# Altium project testMpptCharger.PrjPcb
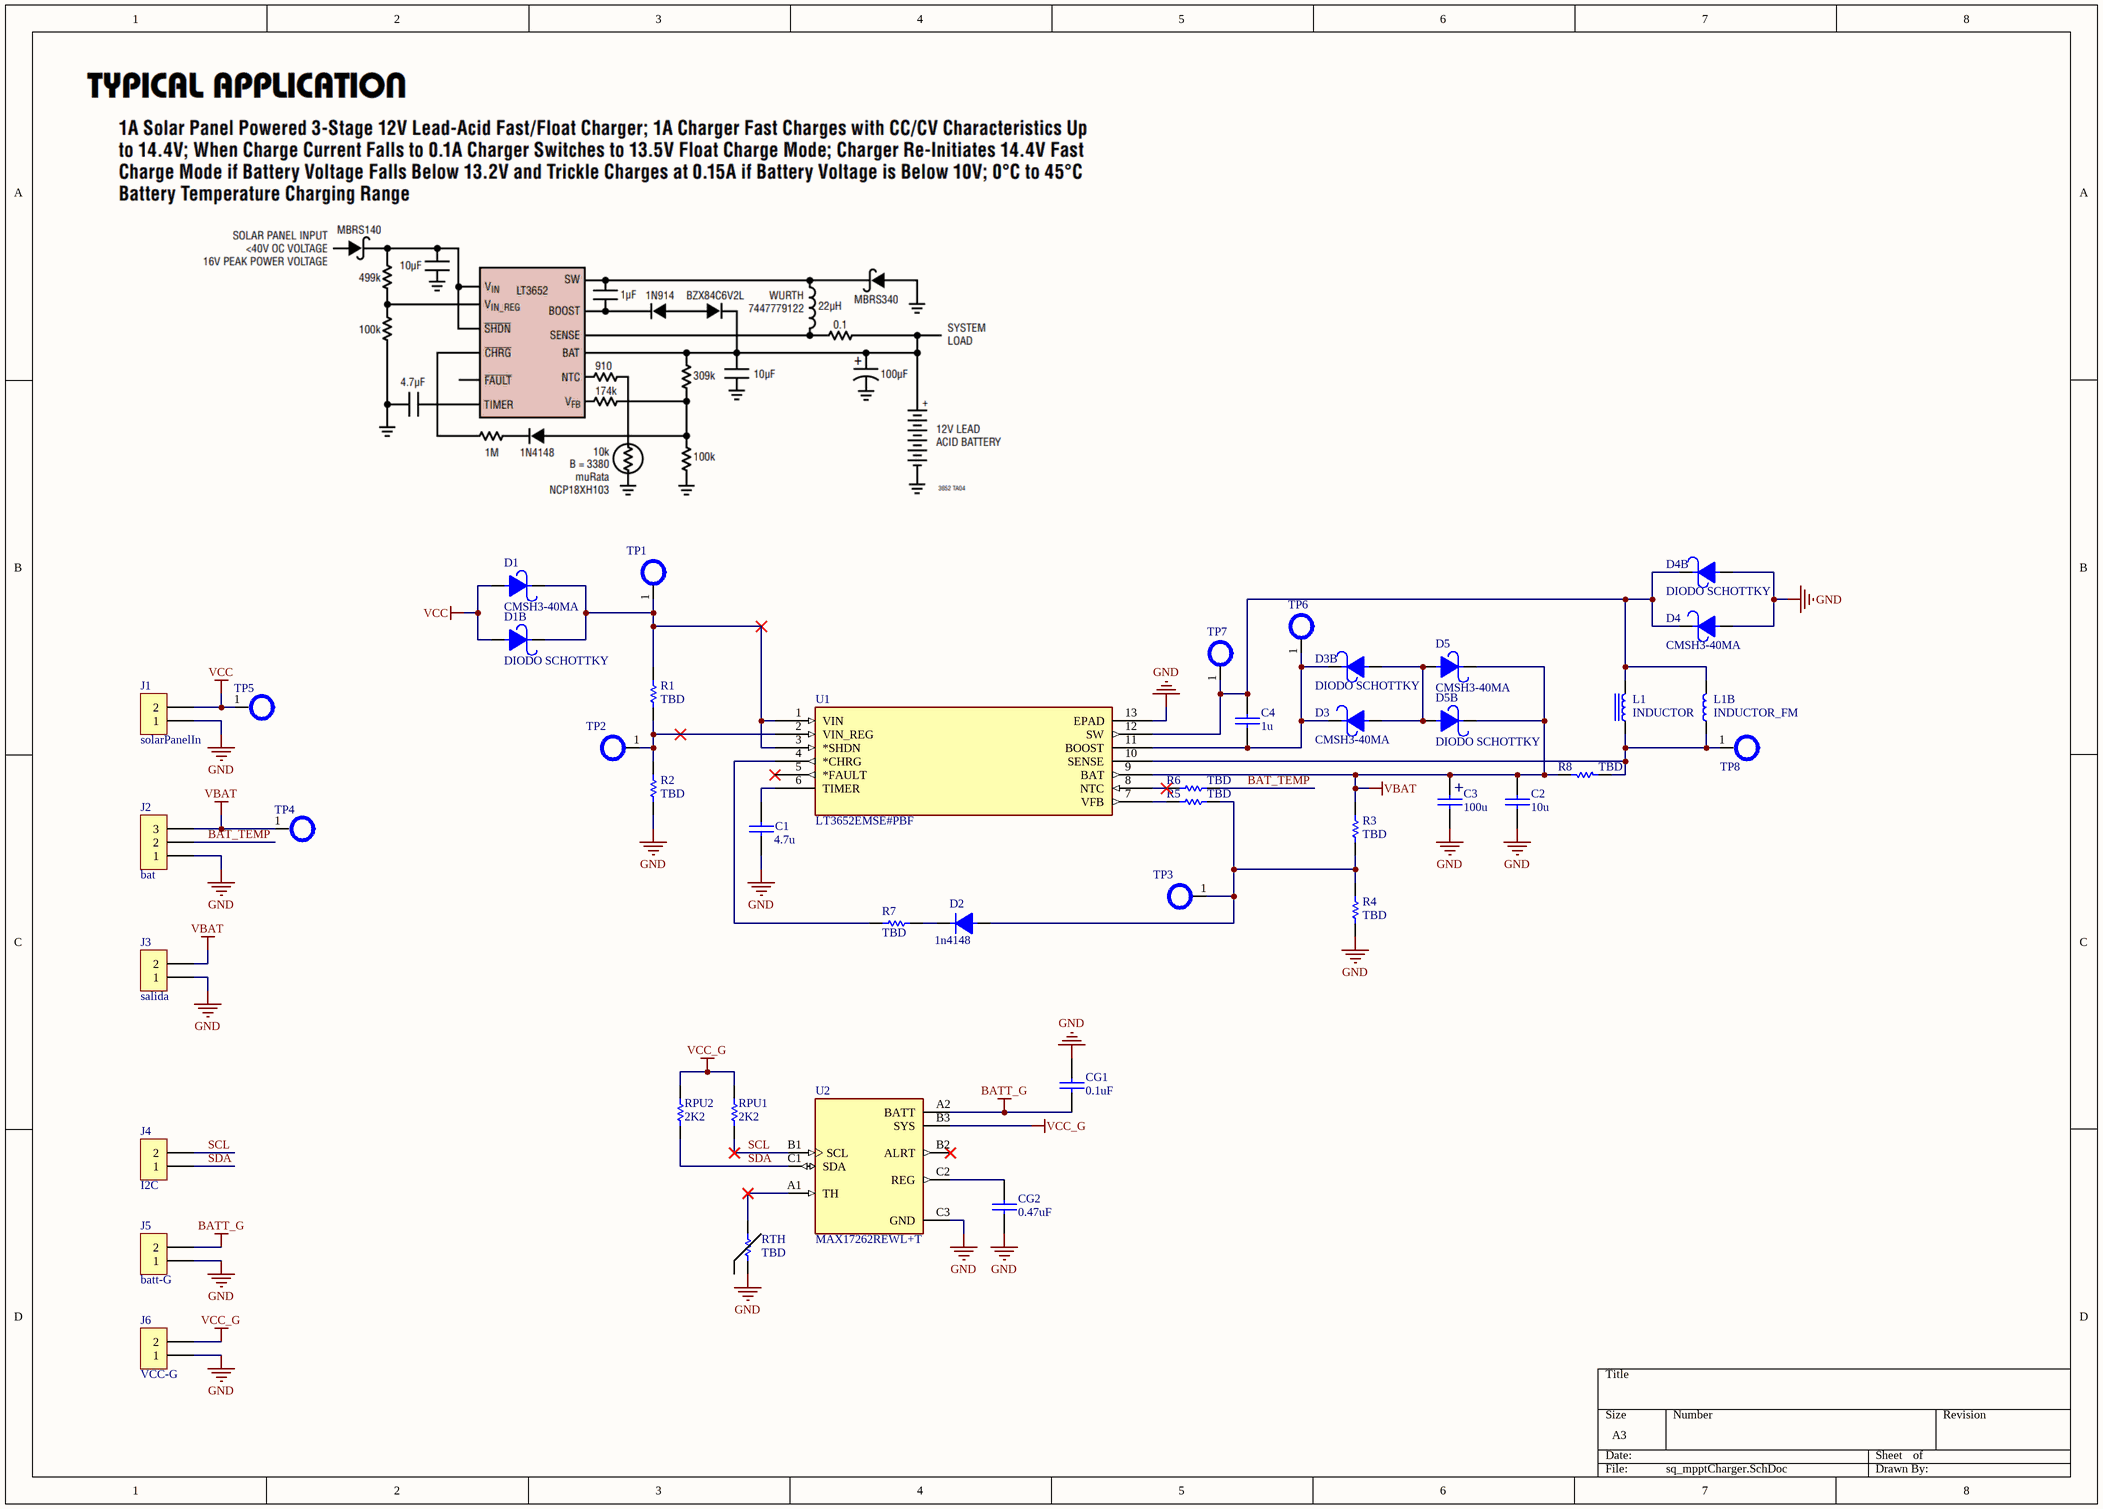
[diagram p0: sq_mpptCharger.SchDoc]
1 sheet, 44 parts. Net scope: global (net labels, ports and power ports of the same name join across sheets).
Board file: pcb_mpptCharger.PcbDoc

## Sheet sq_mpptCharger.SchDoc
size A3; SheetNumber: 1; SheetTotal: 1

### Parts
C1  value 4.7u  [0805]  (hidden comment: CAP)
C2  value 10u  [0805]  (hidden comment: CAP)
C3  value 100u  [CAP100RP2]  (hidden comment: CAPPOL)
C4  value 1u  [0805]  (hidden comment: CAP)
CG1  0.1uF  [0805-CAP-TDK]
CG2  0.47uF  [0805-CAP-TDK]
D1  CMSH3-40MA  [SMAK]
D1B  DIODO SCHOTTKY  [DO41]
D2  value 1n4148  [DO41]  (hidden comment: DIODO)
D3  CMSH3-40MA  [SMAK]
D3B  DIODO SCHOTTKY  [DO41]
D4  CMSH3-40MA  [SMAK]
D4B  DIODO SCHOTTKY  [DO41]
D5  CMSH3-40MA  [SMAK]
D5B  DIODO SCHOTTKY  [DO41]
J1  solarPanelIn  [BORNERA2]
J2  bat  [BORNERA3]
J3  salida  [BORNERA2]
J4  I2C  [BORNERA2]
J5  batt-G  [BORNERA2]
J6  VCC-G  [BORNERA2]
L1  INDUCTOR  [WE-PD SERIES]
L1B  INDUCTOR_FM  [INDUCTOR_FM]
R1  value TBD  [0805]  (hidden comment: RES)
R2  value TBD  [0805]  (hidden comment: RES)
R3  value TBD  [0805]  (hidden comment: RES)
R4  value TBD  [0805]  (hidden comment: RES)
R5  value TBD  [0805]  (hidden comment: RES)
R6  value TBD  [0805]  (hidden comment: RES)
R7  value TBD  [0805]  (hidden comment: RES)
R8  value TBD  [0805]  (hidden comment: RES)
RPU1  2K2  [0805-RES-PANASONIC]
RPU2  2K2  [0805-RES-PANASONIC]
RTH  TBD  [0805-RES-PANASONIC]
TP1  TP  [TP]  (value not drawn)
TP2  TP  [TP]  (value not drawn)
TP3  TP  [TP]  (value not drawn)
TP4  TP  [TP]  (value not drawn)
TP5  TP  [TP]  (value not drawn)
TP6  TP  [TP]  (value not drawn)
TP7  TP  [TP]  (value not drawn)
TP8  TP  [TP]  (value not drawn)
U1  LT3652EMSE#PBF  [LT3652EMSE#PBF]
U2  MAX17262REWL+T  [AD 9-WLP]

### Nets
BATT_G: CG1.1 J5.2 U2.A2(BATT)
GND: C1.2 C2.2 C3.2 CG1.2 CG2.1 D4.1 D4B.1 J1.1 J2.1 J3.1 J5.1 J6.1 R2.1 R4.1 RTH.1 U1.13(EPAD) U2.C3(GND)
VBAT: C2.1 C3.1 D5.2 D5B.2 J2.3 J3.2 R3.2 R8.1 TP4.1 U1.9(BAT)
VCC: D1.1 D1B.1 J1.2 TP5.1
VCC_G: J6.2 RPU1.1 RPU2.2 U2.B3(SYS)
BAT_TEMP: J2.2 R6.1
SCL: J4.2 RPU1.2 U2.B1(SCL)
SDA: J4.1 RPU2.1 U2.C1(SDA)
NetC1_1: C1.1 U1.6(TIMER)
NetC4_1: C4.1 D4.2 D4B.2 L1.2 L1B.2 TP7.1 U1.12(SW)
NetC4_2: C4.2 D3.2 D3B.2 TP6.1 U1.11(BOOST)
NetCG2_2: CG2.2 U2.C2(REG)
NetD1_2: D1.2 D1B.2 R1.2 TP1.1 U1.1(VIN) U1.3(*SHDN)
NetD2_1: D2.1 R3.1 R4.2 R5.1 TP3.1
NetD2_2: D2.2 R7.1
NetD3_1: D3.1 D3B.1 D5.1 D5B.1
NetL1_1: L1.1 L1B.1 R8.2 TP8.1 U1.10(SENSE)
NetR1_1: R1.1 R2.2 TP2.1 U1.2(VIN_REG)
NetR5_2: R5.2 U1.7(VFB)
NetR6_2: R6.2 U1.8(NTC)
NetR7_2: R7.2 U1.4(*CHRG)
NetRTH_2: RTH.2 U2.A1(TH)

Not connected (* = marked no-connect by the designer): U1 5(*FAULT)*; U2 B2(ALRT)*

### Notes on the sheet
- (in symbol CAPPOL) +

### Library data of the parts
CG1 CG2 = CAP-SMD
D1 D3-D5 = DIODO SCHOTTKY
J1 J3-J6 = BORNERA 2
J2 = BORNERA 3
L1B = INDUCTOR_1
RPU1 RPU2 RTH = RES-SMD
U1 = LT3652EMSE#PBF: Power Tracking 2A Battery Charger for Solar Power
U2 = MAX17262REWL+T: Battery Fuel Gauge IC LiFePO4/Li-ion 9-WLP (1.47x1.45)